# EAGLE board schematic_March16 (EAGLE 9.3.0), part 1 of 2
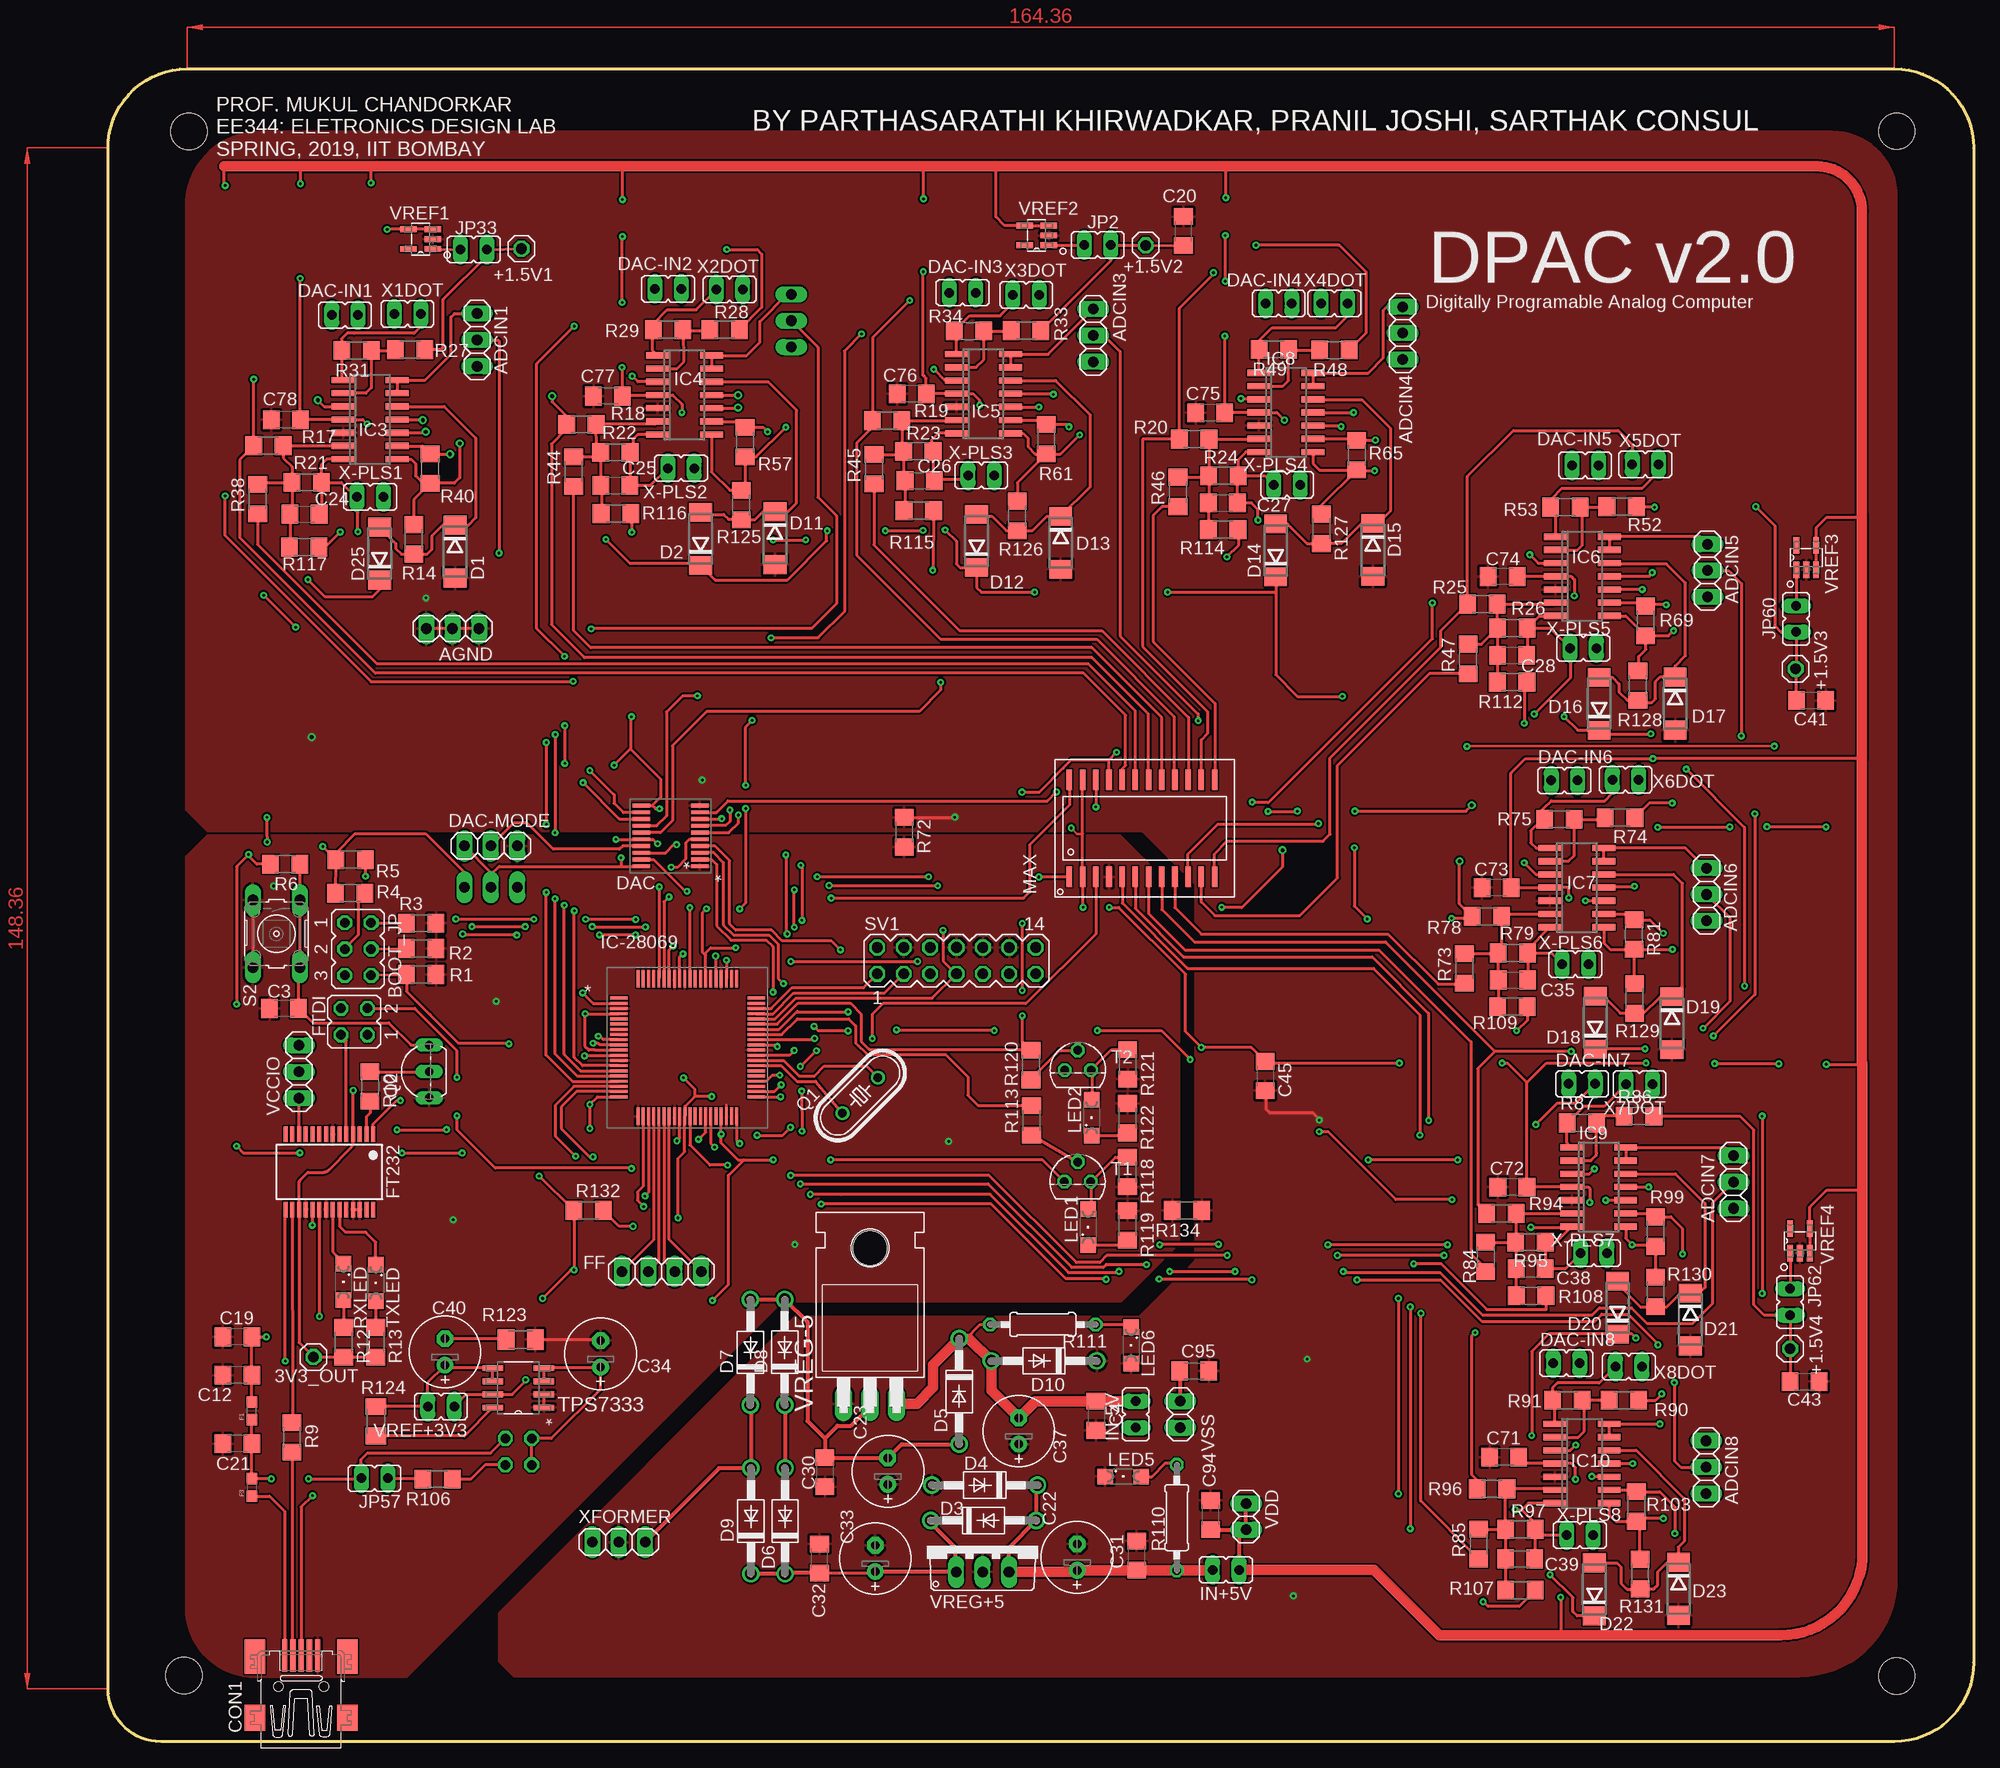
[diagram p2: board, top side]
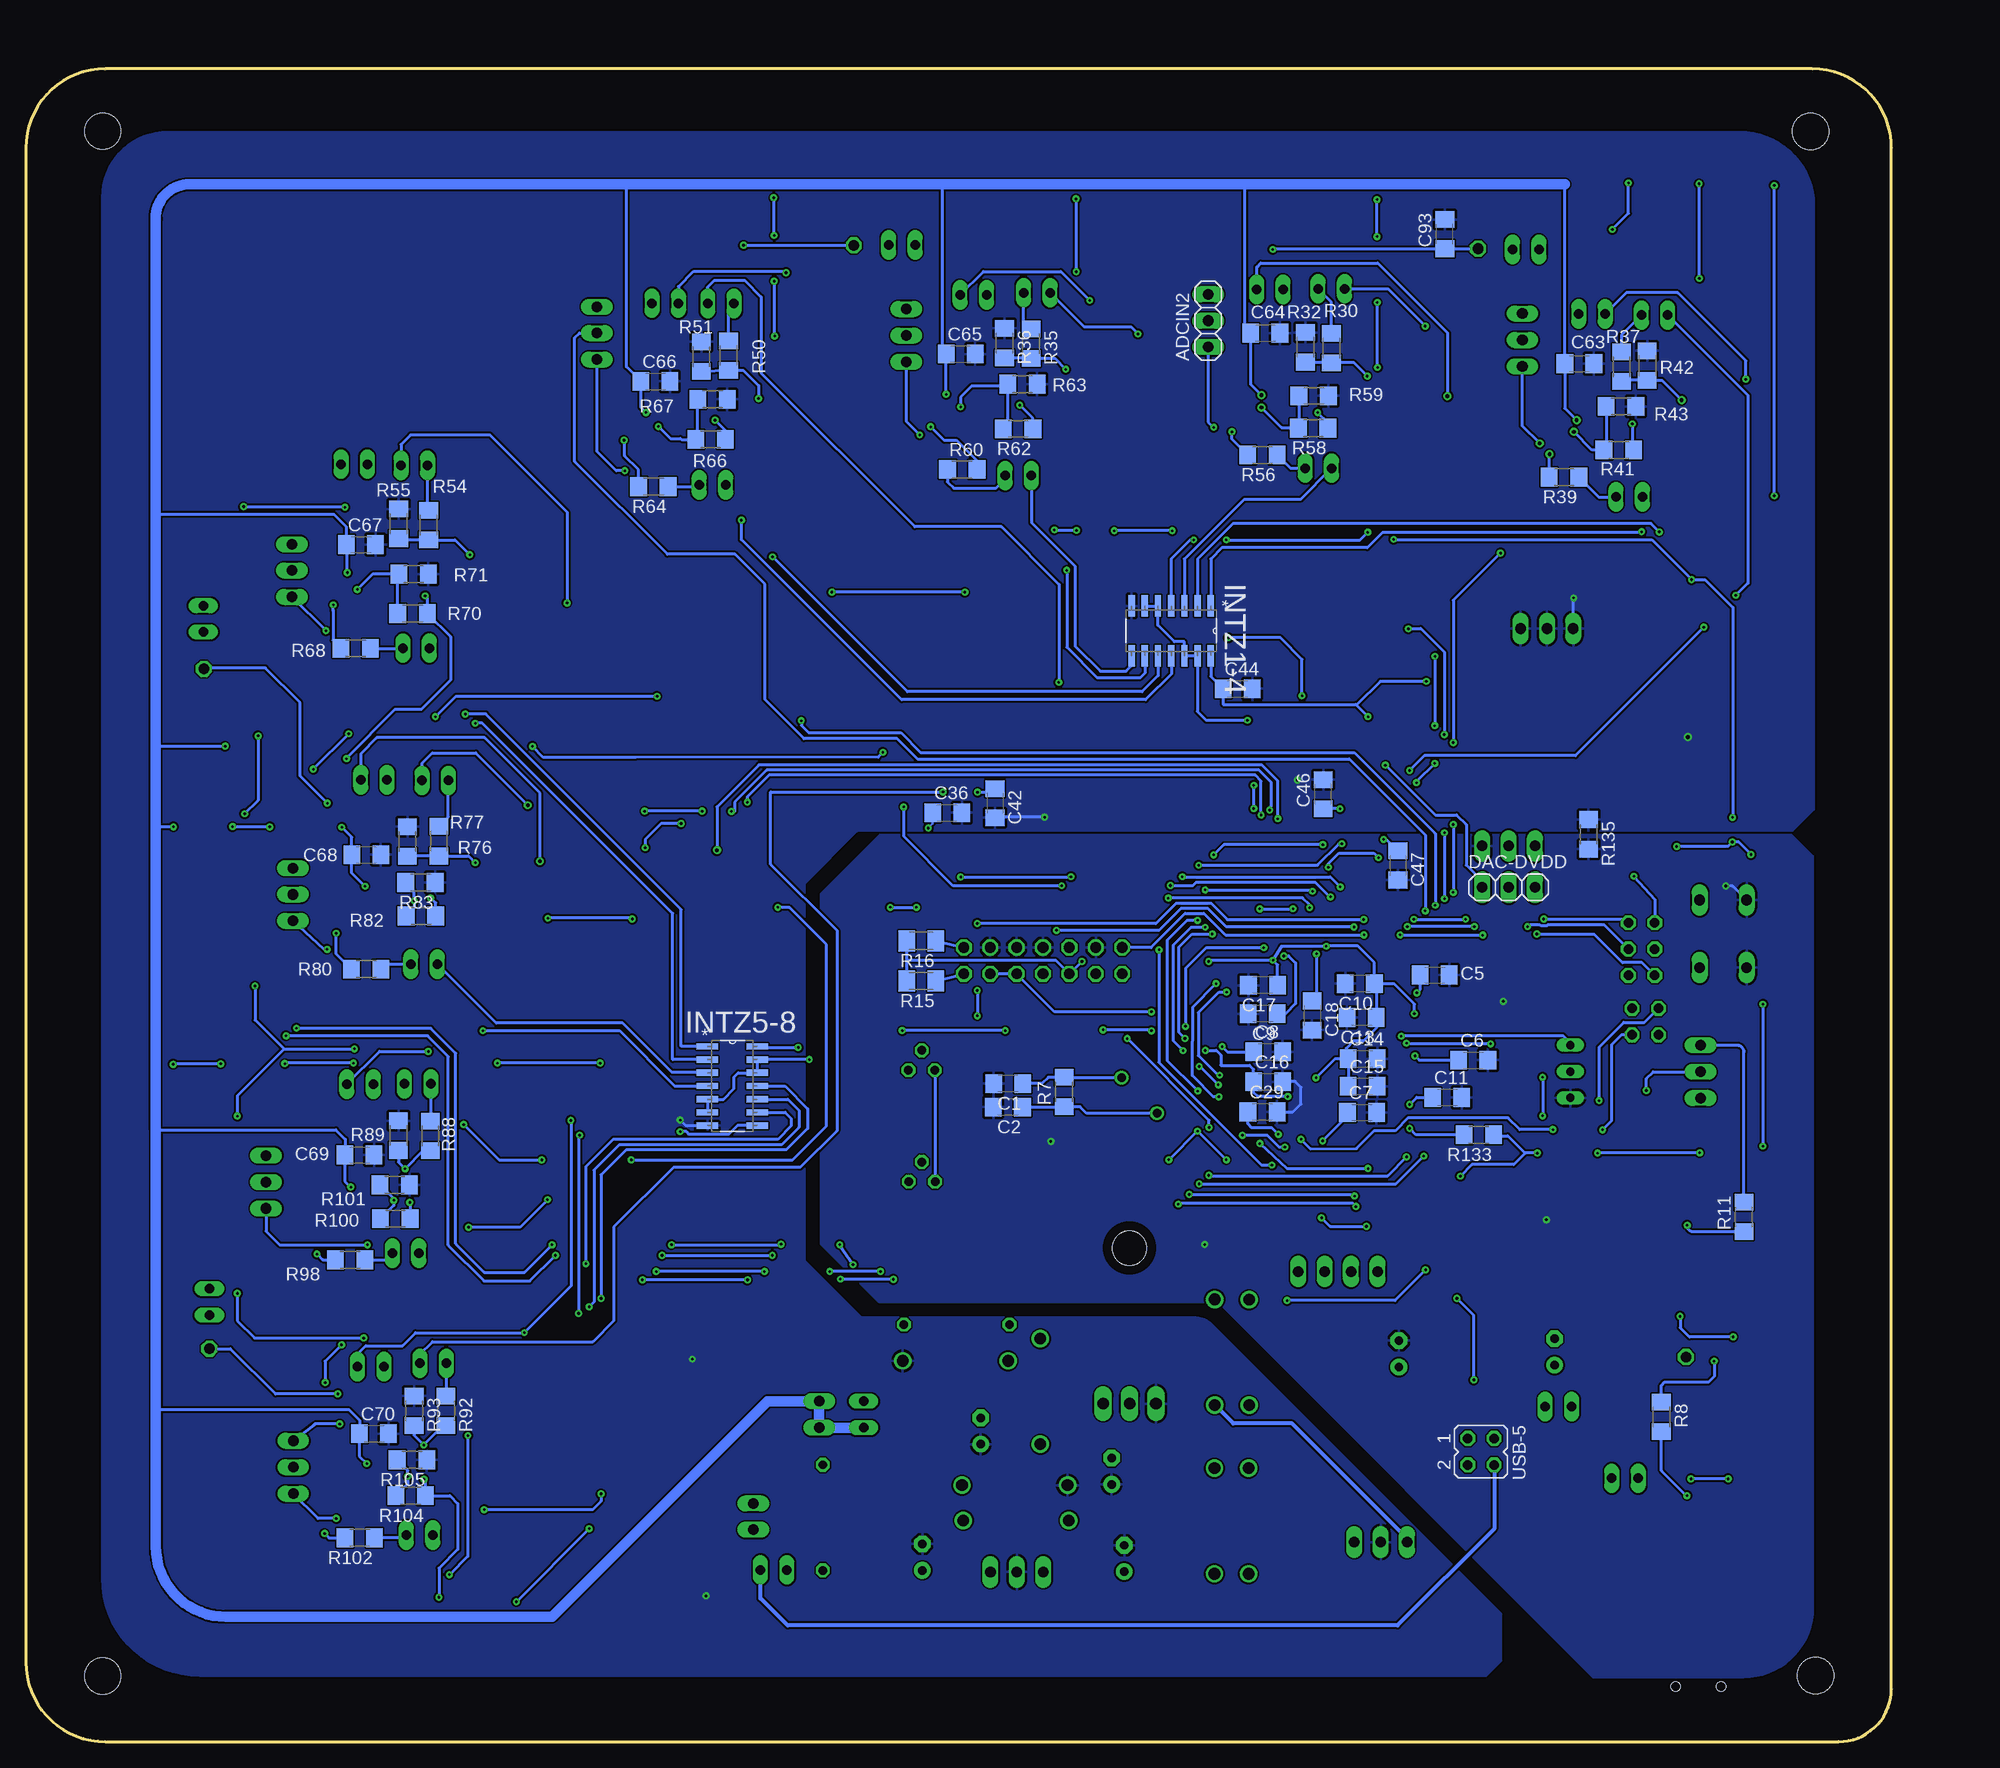
[diagram p3: board, bottom side, seen from below]

Size 179.6 x 161.06 mm. Coordinates in mm from the lower left corner, seen from the top.
Outline: 0,5.08 0,153.44 arc-90 7.62,161.06 171.98,161.06 arc-90 179.6,153.44 179.6,7.62 arc-90 171.98,0 5.08,0 arc-90 0,5.08
Copper layers (1*16): Top 0.035mm / dielectric 1.5mm / Bottom 0.035mm
Design rules "default *": minimum track width 8mil, minimum drill 10mil, track to track 7mil, track to pad 7mil, pad to pad 7mil, via to via 7mil, smd to smd 7mil, copper to edge 10mil, drill to drill 7mil, minimum pad ring 10mil, minimum via ring 8mil, stop-mask expansion 4mil, vias tented up to drill 0mil, thermal gap 10mil
Net classes: 0 default: width 0.203 mm; 1 power: width 0.254 mm
Holes 3.5 mm at 172.21,155.04 172.21,6.3 7.29,6.38 7.8,155.02

## Footprints (pad centres in the part's own frame; a part is rotated, then mirrored left to right if it is on the bottom)
1X01 = drill 1.016 octagon: 1 0,0
1X03 = drill 1.016 long: 1 -2.54,0; 2 0,0; 3 2.54,0
JP3Q = drill 0.914 octagon: 1 -2.54,-1.27; 2 -2.54,1.27; 3 0,-1.27; 4 0,1.27; 5 2.54,-1.27; 6 2.54,1.27
C1206 = smd 1.6 x 1.8: 1 -1.4,0; 2 1.4,0
E2,5-7 = drill 0.813 pad 1.6: + -1.27,0 | drill 0.813 pad 1.6 octagon: - 1.27,0
32005-201 = smd 3.1 x 0.5: 1 3,1.6; 2 3,0.8; 3 3,0; 4 3,-0.8; 5 3,-1.6 | smd 2.5 x 2: M1 -3,-4.45; M2 -3,4.45 | smd 3.3 x 2: M3 2.9,4.45; M4 2.9,-4.45 | hole 0.9: 0,2.2; 0,-2.2
DO214AA = smd 1.8 x 2.2: A 2.55,0; C -2.55,0
DO41-10 = drill 1.118: A 5.08,0; C -5.08,0
PW20 = smd 1.676 x 0.356: 1 -2.819,2.925; 2 -2.819,2.275; 3 -2.819,1.625; 4 -2.819,0.975; 5 -2.819,0.325; 6 -2.819,-0.325; 7 -2.819,-0.975; 8 -2.819,-1.625; 9 -2.819,-2.275; 10 -2.819,-2.925; 11 2.819,-2.925; 12 2.819,-2.275; 13 2.819,-1.625; 14 2.819,-0.975; 15 2.819,-0.325; 16 2.819,0.325; 17 2.819,0.975; 18 2.819,1.625; 19 2.819,2.275; 20 2.819,2.925
JP1 = drill 0.914 long: 1 0,-1.27; 2 0,1.27
0603 = smd 1.1 x 1: 1 -0.85,0; 2 0.85,0
1X04 = drill 1.016 long: 1 -3.81,0; 2 -1.27,0; 3 1.27,0; 4 3.81,0
SSOP28 = smd 0.4 x 1.5: 1 -4.225,-3.625; 2 -3.575,-3.625; 3 -2.925,-3.625; 4 -2.275,-3.625; 5 -1.625,-3.625; 6 -0.975,-3.625; 7 -0.325,-3.625; 8 0.325,-3.625; 9 0.975,-3.625; 10 1.625,-3.625; 11 2.275,-3.625; 12 2.925,-3.625; 13 3.575,-3.625; 14 4.225,-3.625; 15 4.225,3.625; 16 3.575,3.625; 17 2.925,3.625; 18 2.275,3.625; 19 1.625,3.625; 20 0.975,3.625; 21 0.325,3.625; 22 -0.325,3.625; 23 -0.975,3.625; 24 -1.625,3.625; 25 -2.275,3.625; 26 -2.925,3.625; 27 -3.575,3.625; 28 -4.225,3.625
JP2Q = drill 0.914 octagon: 1 -1.27,-1.27; 2 -1.27,1.27; 3 1.27,-1.27; 4 1.27,1.27
SO14 = smd 0.6 x 2.2: 1 -3.81,-2.6; 2 -2.54,-2.6; 3 -1.27,-2.6; 4 0,-2.6; 5 1.27,-2.6; 6 2.54,-2.6; 7 3.81,-2.6; 8 3.81,2.6; 9 2.54,2.6; 10 1.27,2.6; 11 0,2.6; 12 -1.27,2.6; 13 -2.54,2.6; 14 -3.81,2.6
PN80 = smd 1.676 x 0.279: 1 -6.617,4.75; 2 -6.617,4.25; 3 -6.617,3.75; 4 -6.617,3.25; 5 -6.617,2.75; 6 -6.617,2.25; 7 -6.617,1.75; 8 -6.617,1.25; 9 -6.617,0.75; 10 -6.617,0.25; 11 -6.617,-0.25; 12 -6.617,-0.75; 13 -6.617,-1.25; 14 -6.617,-1.75; 15 -6.617,-2.25; 16 -6.617,-2.75; 17 -6.617,-3.25; 18 -6.617,-3.75; 19 -6.617,-4.25; 20 -6.617,-4.75; 41 6.617,-4.75; 42 6.617,-4.25; 43 6.617,-3.75; 44 6.617,-3.25; 45 6.617,-2.75; 46 6.617,-2.25; 47 6.617,-1.75; 48 6.617,-1.25; 49 6.617,-0.75; 50 6.617,-0.25; 51 6.617,0.25; 52 6.617,0.75; 53 6.617,1.25; 54 6.617,1.75; 55 6.617,2.25; 56 6.617,2.75; 57 6.617,3.25; 58 6.617,3.75; 59 6.617,4.25; 60 6.617,4.75 | smd 0.279 x 1.676: 21 -4.75,-6.617; 22 -4.25,-6.617; 23 -3.75,-6.617; 24 -3.25,-6.617; 25 -2.75,-6.617; 26 -2.25,-6.617; 27 -1.75,-6.617; 28 -1.25,-6.617; 29 -0.75,-6.617; 30 -0.25,-6.617; 31 0.25,-6.617; 32 0.75,-6.617; 33 1.25,-6.617; 34 1.75,-6.617; 35 2.25,-6.617; 36 2.75,-6.617; 37 3.25,-6.617; 38 3.75,-6.617; 39 4.25,-6.617; 40 4.75,-6.617; 61 4.75,6.617; 62 4.25,6.617; 63 3.75,6.617; 64 3.25,6.617; 65 2.75,6.617; 66 2.25,6.617; 67 1.75,6.617; 68 1.25,6.617; 69 0.75,6.617; 70 0.25,6.617; 71 -0.25,6.617; 72 -0.75,6.617; 73 -1.25,6.617; 74 -1.75,6.617; 75 -2.25,6.617; 76 -2.75,6.617; 77 -3.25,6.617; 78 -3.75,6.617; 79 -4.25,6.617; 80 -4.75,6.617
SOIC127P600X175-14N = smd 2.057 x 0.61: 1 -4.801,7.62; 2 -4.801,6.35; 3 -4.801,5.08; 4 -4.801,3.81; 5 -4.801,2.54; 6 -4.801,1.27; 7 -4.801,0; 8 0,0; 9 0,1.27; 10 0,2.54; 11 0,3.81; 12 0,5.08; 13 0,6.35; 14 0,7.62
SML1206 = smd 1.5 x 1.5: A 1.75,0; C -1.75,0
21-0042B_24 = smd 1.981 x 0.533: 1 -4.686,6.985; 2 -4.686,5.715; 3 -4.686,4.445; 4 -4.686,3.175; 5 -4.686,1.905; 6 -4.686,0.635; 7 -4.686,-0.635; 8 -4.686,-1.905; 9 -4.686,-3.175; 10 -4.686,-4.445; 11 -4.686,-5.715; 12 -4.686,-6.985; 13 4.686,-6.985; 14 4.686,-5.715; 15 4.686,-4.445; 16 4.686,-3.175; 17 4.686,-1.905; 18 4.686,-0.635; 19 4.686,0.635; 20 4.686,1.905; 21 4.686,3.175; 22 4.686,4.445; 23 4.686,5.715; 24 4.686,6.985
HC49/S = drill 0.813: 1 -2.413,0; 2 2.413,0
TO92-EBC = drill 0.813 long: B 0,-1.27; C -2.54,-1.27; E 2.54,-1.27
R1206 = smd 1.6 x 1.803: 1 -1.422,0; 2 1.422,0
M1206 = smd 1.6 x 2: 1 -1.4,0; 2 1.4,0
0207/10 = drill 0.813 octagon: 1 -5.08,0; 2 5.08,0
B3F-10XX = drill 1.016 long: 1 -3.251,2.261; 2 3.251,2.261; 3 -3.251,-2.261; 4 3.251,-2.261
MA07-2 = drill 1.016 octagon: 1 -7.62,-1.27; 2 -7.62,1.27; 3 -5.08,-1.27; 4 -5.08,1.27; 5 -2.54,-1.27; 6 -2.54,1.27; 7 0,-1.27; 8 0,1.27; 9 2.54,-1.27; 10 2.54,1.27; 11 5.08,-1.27; 12 5.08,1.27; 13 7.62,-1.27; 14 7.62,1.27
TO92 = drill 0.813 octagon: 1 1.27,0; 2 0,1.905; 3 -1.27,0
SOIC127P600X175-8N = smd 1.981 x 0.559: 1 -2.464,1.905; 2 -2.464,0.635; 3 -2.464,-0.635; 4 -2.464,-1.905; 5 2.464,-1.905; 6 2.464,-0.635; 7 2.464,0.635; 8 2.464,1.905
1X02 = drill 1.016 long: 1 -1.27,0; 2 1.27,0
DDC0005A_N = smd 1.575 x 0.559: 1 -1.168,0.95; 2 -1.168,0; 3 -1.168,-0.95; 4 1.168,-0.95; 5 1.168,0.95
TO220V = drill 1.016 long: 1 -2.54,-2.54; 2 0,-2.54; 3 2.54,-2.54
TO220H = drill 1.118 long: 1 -2.54,-10.16; 2 0,-10.16; 3 2.54,-10.16 | hole 3.302: 0,4.826

## Placement (x,y rotation side)
3V3_OUT  [1X01]  19.79,37.03 0 top
+1.5V1  [1X01]  39.8,143.74 0 top
+1.5V2  [1X01]  99.9,144.07 0 top
+1.5V3  [1X01]  162.48,103.28 270 top
+1.5V4  [1X01]  161.95,37.82 270 top
ADCIN1  [1X03]  35.53,134.95 90 top
ADCIN2  [1X03]  65.79,136.8 90 bottom
ADCIN3  [1X03]  94.84,135.38 90 top
ADCIN4  [1X03]  124.64,135.61 90 top
ADCIN5  [1X03]  154,112.75 90 top
ADCIN6  [1X03]  153.9,81.56 90 top
ADCIN7  [1X03]  156.49,53.87 90 top
ADCIN8  [1X03]  153.87,26.42 90 top
AGND  [1X03]  33.17,107.16 180 top
BOOT_JP  [JP3Q]  24.05,76.3 270 top
C1  36p  [C1206]  85.04,63.35 180 bottom
C2  36p  [C1206]  85.06,61.09 180 bottom
C3  0.1u  [C1206]  16.94,70.59 180 top
C4  0.1uF  [C1206]  95.12,31.37 270 top
C5  2.2u  [C1206]  43.97,73.81 0 bottom
C6  2.2u  [C1206]  40.26,65.61 0 bottom
C7  2.2u  [C1206]  50.98,60.58 0 bottom
C8  2.2u  [C1206]  60.02,66.42 0 bottom
C9  2.2u  [C1206]  60.53,70.08 180 bottom
C10  2.2u  [C1206]  51.18,72.97 180 bottom
C11  2.2u  [C1206]  42.77,62.03 0 bottom
C12  100nF  [C1206]  12.45,35.28 180 top
C13  2.2u  [C1206]  51,69.72 180 bottom
C14  2.2u  [C1206]  50.9,65.74 0 bottom
C15  2.2u  [C1206]  50.9,63.09 0 bottom
C16  2.2u  [C1206]  60.02,63.53 0 bottom
C17  2.2u  [C1206]  60.5,72.82 180 bottom
C18  2.2u  [C1206]  55.78,69.9 270 bottom
C19  4.7uF  [C1206]  12.45,38.96 180 top
C20  2.2u  [C1206]  103.53,145.44 90 top
C21  10nF  [C1206]  12.45,28.68 180 top
C22  10uF  [E2,5-7]  93.29,17.75 90 top
C23  1000uF  [E2,5-7]  75.08,26.03 90 top
C24  4.7nF  [C1206]  18.92,118.19 0 top
C25  4.7nF  [C1206]  48.84,120.95 0 top
C26  4.7nF  [C1206]  78.13,121.41 0 top
C27  4.7nF  [C1206]  107.34,119.25 0 top
C28  4.7nF  [C1206]  135.18,104.57 0 top
C29  0.1u  [C1206]  60.55,60.63 0 bottom
C30  0.1uF  [C1206]  69.01,25.93 270 top
C31  0.1uF  [C1206]  99.03,17.91 90 top
C32  0.1uF  [C1206]  68.5,17.63 90 top
C33  1000uF  [E2,5-7]  73.86,17.63 90 top
C34  0.1uF  [E2,5-7]  47.42,37.34 90 top
C35  4.7nF  [C1206]  135.25,73.33 0 top
C36  2.2u  [C1206]  90.91,89.43 0 bottom
C37  10uF  [E2,5-7]  87.68,29.9 90 top
C38  4.7nF  [C1206]  136.96,45.54 0 top
C39  4.7nF  [C1206]  135.94,17.6 0 top
C40  10uF  [E2,5-7]  32.44,37.52 90 top
C41  2.2u  [C1206]  163.96,100.25 0 top
C42  2.2u  [C1206]  86.31,90.35 270 bottom
C43  2.2u  [C1206]  163.35,34.67 0 top
C44  2.2u  [C1206]  62.94,101.37 0 bottom
C45  2.2u  [C1206]  111.4,64.08 270 top
C46  1uF  [C1206]  54.71,91.21 90 bottom
C47  1uF  [C1206]  47.52,84.35 270 bottom
C63  2.2u  [C1206]  30.05,132.66 0 bottom
C64  2.2u  [C1206]  60.27,135.61 0 bottom
C65  2.2u  [C1206]  89.61,133.6 0 bottom
C66  2.2u  [C1206]  119,130.96 0 bottom
C67  2.2u  [C1206]  147.35,115.24 0 bottom
C68  2.2u  [C1206]  146.84,85.39 0 bottom
C69  2.2u  [C1206]  147.5,56.49 0 bottom
C70  2.2u  [C1206]  146.1,29.64 0 bottom
C71  2.2u  [C1206]  134.42,27.38 180 top
C72  2.2u  [C1206]  135.2,53.39 180 top
C73  2.2u  [C1206]  133.68,82.22 180 top
C74  2.2u  [C1206]  134.26,112.17 180 top
C75  2.2u  [C1206]  106.12,127.94 180 top
C76  2.2u  [C1206]  77.37,129.77 180 top
C77  2.2u  [C1206]  48.13,129.54 180 top
C78  2.2u  [C1206]  17.12,127.25 180 top
C93  2.2u  [C1206]  43,145.14 90 bottom
C94  2.2u  [C1206]  106.15,21.82 90 top
C95  2.2u  [C1206]  104.57,35.69 0 top
CON1  UBC05V128-B0C04D  [32005-201]  18.59,5.28 90 top
D1  [DO214AA]  33.4,114.58 270 top
D2  [DO214AA]  57.05,115.8 90 top
D3  1N4004  [DO41-10]  84.28,21.29 0 top
D4  1N4004  [DO41-10]  84.4,24.69 180 top
D5  1N4004  [DO41-10]  81.94,33.71 270 top
D6  1N4004  [DO41-10]  65.18,21.23 90 top
D7  1N4004  [DO41-10]  61.85,37.47 90 top
D8  1N4004  [DO41-10]  65.15,37.49 90 top
D9  1N4004  [DO41-10]  61.9,21.23 90 top
D10  1N4004  [DO41-10]  90.12,36.65 180 top
D11  [DO214AA]  64.21,115.87 270 top
D12  [DO214AA]  83.62,115.6 90 top
D13  [DO214AA]  91.72,115.42 270 top
D14  [DO214AA]  112.42,114.68 90 top
D15  [DO214AA]  121.77,114.73 270 top
D16  [DO214AA]  143.56,99.92 90 top
D17  [DO214AA]  150.88,99.95 270 top
D18  [DO214AA]  143.18,69.22 90 top
D19  [DO214AA]  150.57,69.16 270 top
D20  [DO214AA]  145.34,41.78 90 top
D21  [DO214AA]  152.35,40.64 270 top
D22  [DO214AA]  143.1,14.66 90 top
D23  [DO214AA]  151.21,14.71 270 top
D25  [DO214AA]  26.14,114.38 90 top
DAC  TLV5610_PW_20  [PW20]  54.15,87.2 180 top
DAC-DVDD  [1X03]  36.86,82.25 0 bottom
DAC-IN1  [JP1]  22.81,137.34 90 top
DAC-IN2  [JP1]  53.92,139.88 90 top
DAC-IN3  [JP1]  82.27,139.5 90 top
DAC-IN4  [JP1]  112.7,138.46 270 top
DAC-IN5  [JP1]  142.21,122.89 270 top
DAC-IN6  [JP1]  140.21,92.53 270 top
DAC-IN7  [JP1]  141.91,63.32 270 top
DAC-IN8  [JP1]  140.41,36.42 270 top
DAC-MODE  [1X03]  36.86,86.23 0 top
F1  500mA  [0603]  13.84,31.85 90 top
F3  500mA  [0603]  13.87,24.49 90 top
FF  [1X04]  53.29,45.26 0 top
FT232  FT232RL  [SSOP28]  21.31,54.84 180 top
FTDI  [JP2Q]  23.7,69.32 90 top
IC3  TL084D  [SO14]  25.22,127.28 270 top
IC4  TL084D  [SO14]  55.5,129.64 270 top
IC5  TL084D  [SO14]  84.28,129.77 270 top
IC6  TL084D  [SO14]  141.94,112.19 270 top
IC7  TL084D  [SO14]  141.4,82.22 270 top
IC8  TL084D  [SO14]  113.41,127.97 270 top
IC9  TL084D  [SO14]  143.51,53.39 270 top
IC10  TL084D  [SO14]  141.91,26.77 270 top
IC-28069  TMS320F28069_PN_80  [PN80]  55.78,66.83 0 top
IN+5V  [JP1]  107.62,16.54 90 top
IN-5V  [JP1]  98.96,31.5 0 top
INTZ1-4  TS12A44514DR  [SOIC127P600X175-14N]  73.15,104.55 270 bottom
INTZ5-8  TS12A44514DR  [SOIC127P600X175-14N]  109.19,59.31 0 bottom
JP2  [JP1]  95.28,144.09 90 top
JP33  [JP1]  35.2,143.66 90 top
JP57  [JP1]  25.65,25.35 270 top
JP60  [JP1]  162.53,108.1 0 top
JP62  [JP1]  161.95,42.32 0 top
LED1  [SML1206]  94.36,49.53 90 top
LED2  [SML1206]  94.69,60.07 90 top
LED5  [SML1206]  97.74,25.53 0 top
LED6  [SML1206]  98.5,38.15 270 top
MAX  MAX395CWG+  [21-0042B_24]  99.54,87.93 90 top
Q1  [HC49/S]  72.42,62.2 45 top
Q2  BC557  [TO92-EBC]  29.64,64.52 90 top
R1  2.2k  [R1206]  30.15,73.86 180 top
R2  2.2k  [R1206]  30.15,76.35 180 top
R3  2.2k  [R1206]  30.15,78.79 180 top
R4  820  [R1206]  23.32,81.69 180 top
R5  820  [R1206]  23.37,84.91 180 top
R6  2.2k  [R1206]  17.04,84.48 180 top
R7  1M  [R1206]  79.65,62.53 90 bottom
R8  33  [R1206]  22.15,31.27 270 bottom
R9  33  [R1206]  17.7,29.29 270 top
R10  2.2k  [R1206]  25.22,63.07 270 top
R11  10k  [R1206]  14.2,50.52 90 bottom
R12  270  [R1206]  22.68,38.46 270 top
R13  270  [R1206]  25.76,38.46 270 top
R14  [R1206]  29.44,115.75 270 top
R15  4.7k  [M1206]  93.4,73.23 180 bottom
R16  4.7k  [M1206]  93.4,77.09 180 bottom
R17  10k  [R1206]  15.44,124.76 0 top
R18  10k  [R1206]  45.57,126.82 0 top
R19  10k  [R1206]  75.01,127.18 0 top
R20  10k  [R1206]  104.57,125.4 0 top
R21  200k  [R1206]  19.13,121.23 0 top
R22  200k  [R1206]  48.84,124.13 0 top
R23  200k  [R1206]  78,124.23 0 top
R24  200k  [R1206]  107.39,121.87 0 top
R25  10k  [R1206]  132.31,109.52 0 top
R26  200k  [R1206]  135.2,107.21 0 top
R27  10k  [R1206]  29.08,134.01 180 top
R28  10k  [R1206]  59.36,135.94 180 top
R29  33k  [R1206]  53.92,135.94 180 top
R30  10k  [R1206]  53.92,134.16 270 bottom
R31  33k  [R1206]  23.93,133.93 180 top
R32  33k  [R1206]  56.41,134.24 270 bottom
R33  10k  [R1206]  88.39,135.84 180 top
R34  33k  [R1206]  82.91,135.81 180 top
R35  10k  [R1206]  82.83,134.59 270 bottom
R36  33k  [R1206]  85.39,134.65 270 bottom
R37  10k  [R1206]  25.98,132.38 270 bottom
R38  [R1206]  14.4,119.63 90 top
R39  33k  [R1206]  31.52,121.74 180 bottom
R40  10k  [R1206]  31.01,122.55 270 top
R41  33k  [R1206]  26.26,124.36 180 bottom
R42  33k  [R1206]  23.52,132.49 270 bottom
R43  10k  [R1206]  26.03,128.55 180 bottom
R44  [R1206]  44.83,122.28 90 top
R45  [R1206]  73.74,122.5 90 top
R46  [R1206]  103,120.32 90 top
R47  [R1206]  130.94,104.24 90 top
R48  10k  [R1206]  118.06,133.98 180 top
R49  33k  [R1206]  112.24,134.04 180 top
R50  10k  [R1206]  111.96,133.45 270 bottom
R51  33k  [R1206]  114.58,133.35 270 bottom
R52  10k  [R1206]  145.72,118.9 180 top
R53  33k  [R1206]  140.31,118.85 180 top
R54  10k  [R1206]  140.84,117.12 270 bottom
R55  33k  [R1206]  143.71,117.25 270 bottom
R56  33k  [R1206]  60.55,123.88 180 bottom
R57  10k  [R1206]  61.34,125.12 270 top
R58  33k  [R1206]  55.68,126.47 180 bottom
R59  10k  [R1206]  55.63,129.57 180 bottom
R60  33k  [R1206]  89.46,122.48 0 bottom
R61  10k  [R1206]  90.32,125.4 270 top
R62  33k  [R1206]  84.07,126.39 180 bottom
R63  10k  [R1206]  83.67,130.68 180 bottom
R64  33k  [R1206]  119.2,120.83 180 bottom
R65  10k  [R1206]  120.22,123.85 270 top
R66  33k  [R1206]  113.69,125.37 180 bottom
R67  10k  [R1206]  113.51,129.24 180 bottom
R68  33k  [R1206]  147.85,105.26 180 bottom
R69  10k  [R1206]  148.03,107.9 270 top
R70  33k  [R1206]  142.39,108.61 180 bottom
R71  10k  [R1206]  142.29,112.39 180 bottom
R72  0  [R1206]  76.66,87.55 270 top
R73  [R1206]  130.58,74.45 90 top
R74  10k  [R1206]  145.57,88.95 180 top
R75  33k  [R1206]  139.73,88.8 180 top
R76  10k  [R1206]  139.85,86.69 270 bottom
R77  33k  [R1206]  142.88,86.66 270 bottom
R78  10k  [R1206]  132.74,79.45 0 top
R79  200k  [R1206]  135.25,75.92 0 top
R80  33k  [R1206]  146.86,74.37 180 bottom
R81  10k  [R1206]  146.91,77.7 270 top
R82  33k  [R1206]  141.58,79.48 180 bottom
R83  10k  [R1206]  141.63,82.7 180 bottom
R84  [R1206]  132.64,46.66 90 top
R85  [R1206]  131.95,19.02 90 top
R86  10k  [R1206]  147.4,60.22 180 top
R87  33k  [R1206]  141.88,59.56 180 top
R88  10k  [R1206]  140.67,58.32 270 bottom
R89  33k  [R1206]  143.74,58.34 270 bottom
R90  10k  [R1206]  145.95,32.87 180 top
R91  33k  [R1206]  140.49,32.87 180 top
R92  10k  [R1206]  139.17,31.85 270 bottom
R93  33k  [R1206]  142.24,31.85 270 bottom
R94  10k  [R1206]  134.14,50.85 0 top
R95  200k  [R1206]  136.96,48.08 0 top
R96  10k  [R1206]  133.25,24.33 0 top
R97  200k  [R1206]  135.97,20.45 0 top
R98  33k  [R1206]  148.39,46.38 180 bottom
R99  10k  [R1206]  149,49.1 270 top
R100  33k  [R1206]  144.04,50.34 180 bottom
R101  10k  [R1206]  144.09,53.59 180 bottom
R102  33k  [R1206]  147.47,19.61 180 bottom
R103  10k  [R1206]  147.14,22.63 270 top
R104  33k  [R1206]  142.57,23.67 180 bottom
R105  10k  [R1206]  142.44,27.13 180 bottom
R106  0  [R1206]  31.72,25.27 180 top
R107  [R1206]  135.97,14.58 0 top
R108  [R1206]  137.01,42.93 0 top
R109  [R1206]  135.2,70.76 0 top
R110  1K  [0207/10]  102.9,21.56 270 top
R111  1K  [0207/10]  89.99,40.16 180 top
R112  [R1206]  135.18,102.01 0 top
R113  470  [R1206]  88.9,59.82 90 top
R114  [R1206]  107.37,116.69 0 top
R115  [R1206]  78.05,118.52 0 top
R116  [R1206]  48.9,118.24 0 top
R117  [R1206]  18.87,115.01 0 top
R118  10k  [R1206]  98.15,54.84 270 top
R119  470  [R1206]  98.15,49.68 270 top
R120  470  [R1206]  88.85,65.13 90 top
R121  10k  [R1206]  98.17,65.2 270 top
R122  470  [R1206]  98.15,60.02 270 top
R123  1  [M1206]  39.73,38.71 0 top
R124  1  [M1206]  25.78,30.84 270 top
R125  [R1206]  60.96,119.05 270 top
R126  [R1206]  87.53,118.01 270 top
R127  [R1206]  116.81,116.76 270 top
R128  [R1206]  147.29,101.68 270 top
R129  [R1206]  146.96,71.53 270 top
R130  [R1206]  149,43.28 270 top
R131  [R1206]  147.5,16.13 270 top
R132  0  [R1206]  46.28,51.13 0 top
R133  0  [R1206]  39.73,58.42 180 bottom
R134  0  [R1206]  103.89,51.13 180 top
R135  0  [R1206]  29.16,87.35 270 bottom
RXLED  [SML1206]  22.66,44.25 270 top
S2  [B3F-10XX]  16.21,77.77 270 top
SV1  JTAG  [MA07-2]  81.69,75.18 0 top
T1  BC547  [TO92]  93.34,53.9 0 top
T2  BC547  [TO92]  93.37,64.64 0 top
TPS7333  TPS7333QD  [SOIC127P600X175-8N]  39.5,34.06 180 top
TXLED  [SML1206]  25.78,44.17 270 top
USB-5  [JP2Q]  39.52,27.91 270 bottom
VCCIO  [1X03]  18.39,64.49 270 top
VDD  [1X02]  109.58,21.67 270 top
VREF1  REF2030AIDDCR  [DDC0005A_N]  30.1,144.65 180 top
VREF2  REF2030AIDDCR  [DDC0005A_N]  89.41,145.01 180 top
VREF3  REF2030AIDDCR  [DDC0005A_N]  163.5,114 90 top
VREF4  REF2030AIDDCR  [DDC0005A_N]  162.89,48.21 90 top
VREF+3V3  [JP1]  32.05,32.26 90 top
VREG+5  7805TV  [TO220V]  84.2,18.87 0 top
VREG-5  [TO220H]  73.36,42.7 0 top
VSS  [1X02]  103.23,31.5 270 top
X1DOT  [JP1]  28.83,137.46 270 top
X2DOT  [JP1]  59.84,139.8 90 top
X3DOT  [JP1]  88.39,139.29 90 top
X4DOT  [JP1]  118.06,138.48 270 top
X5DOT  [JP1]  148.01,122.99 270 top
X6DOT  [JP1]  146.1,92.61 90 top
X7DOT  Int_inp  [JP1]  147.45,63.3 90 top
X8DOT  [JP1]  146.41,36.09 90 top
X-PLS1  [JP1]  25.25,119.84 90 top
X-PLS2  [JP1]  55.17,122.61 90 top
X-PLS3  [JP1]  84.07,121.89 90 top
X-PLS4  [JP1]  113.51,121.01 90 top
X-PLS5  [JP1]  142.04,105.28 90 top
X-PLS6  [JP1]  141.27,74.85 90 top
X-PLS7  pls  [JP1]  143.05,47.02 90 top
X-PLS8  [JP1]  141.71,19.89 90 top
XFORMER  [1X03]  49.17,19.2 0 top